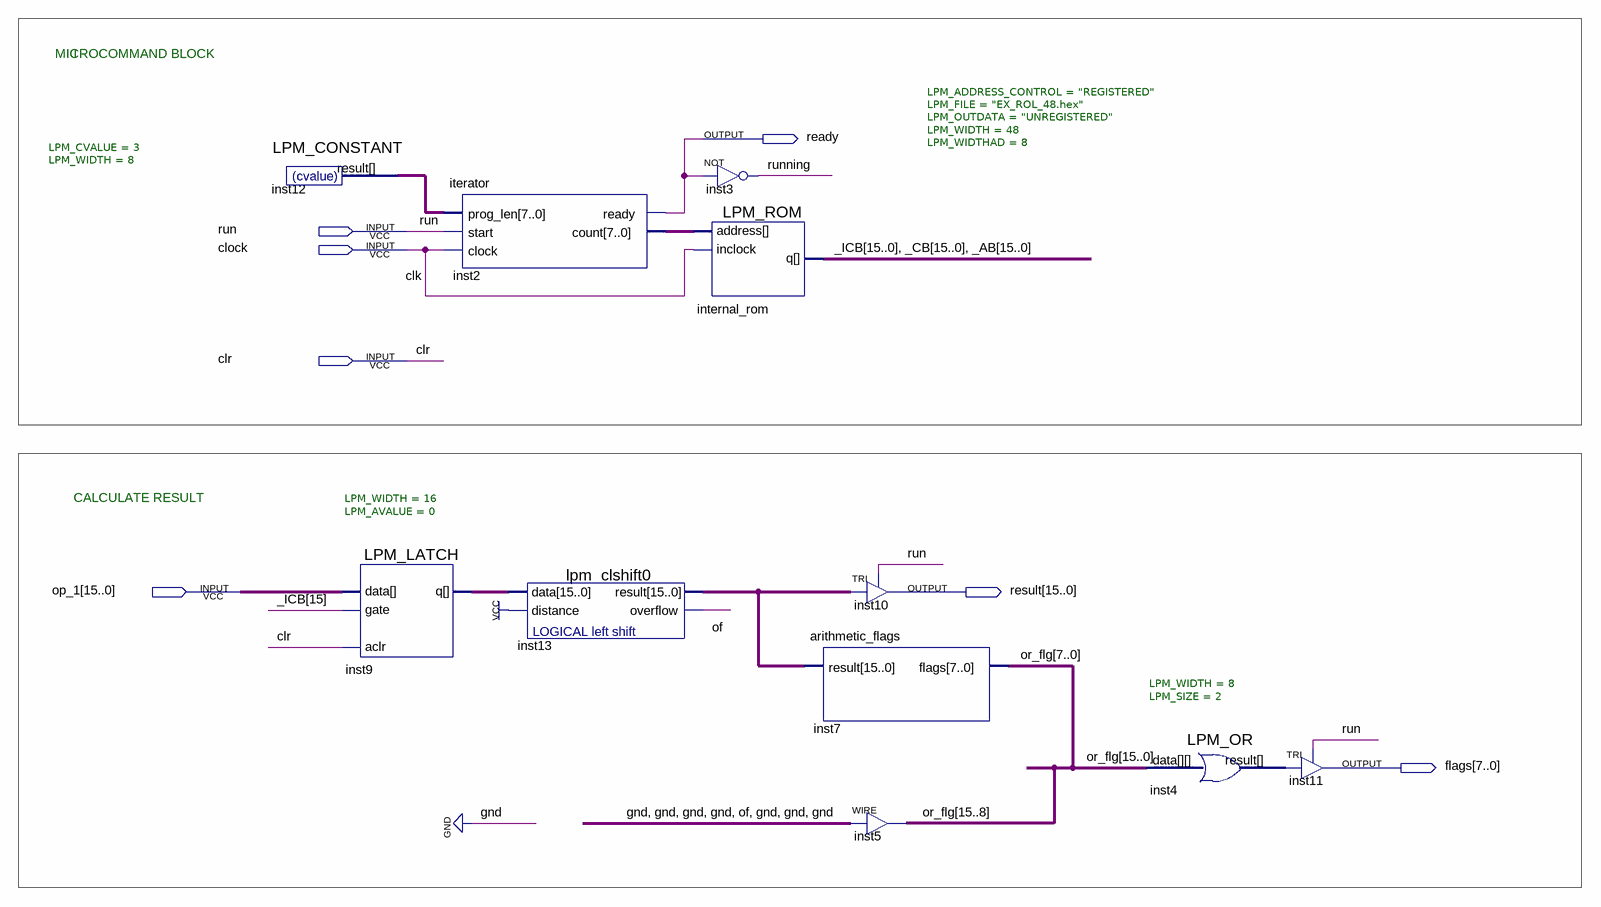
[diagram p0: schematic sheet]
// Quartus schematic EX_ROL.bdf as structural Verilog: 11 symbols, 7 pins
module EX_ROL (
  input  run,
  input  clock,
  input  clr,
  input  [15:0] op_1,
  output ready,
  output [15:0] result,
  output [7:0] flags
);

  wire of, running;
  wire [7:0] inst2_count, inst4_result, inst12_result;
  wire [15:0] _AB, _CB, _ICB, inst9_q, inst13_result, or_flg;

  LPM_CONSTANT #(.LPM_CVALUE(3), .LPM_WIDTH(8)) inst12 (.result(inst12_result));
  LPM_LATCH #(.LPM_WIDTH(16), .LPM_AVALUE(0)) inst9 (.aclr(clr), .data(op_1), .gate(_ICB[15]), .q(inst9_q));
  iterator inst2 (.prog_len(inst12_result), .start(run), .clock(clock), .ready(ready), .count(inst2_count));
  lpm_clshift0 inst13 (.data(inst9_q), .distance(1'b1), .result(inst13_result), .overflow(of));
  not inst3 (running, ready);
  LPM_ROM #(.LPM_ADDRESS_CONTROL("REGISTERED"), .LPM_FILE("EX_ROL_48.hex"), .LPM_OUTDATA("UNREGISTERED"), .LPM_WIDTH(48), .LPM_WIDTHAD(8)) internal_rom (
    .address(inst2_count), .inclock(clock), .q({_ICB, _CB, _AB}));
  TRI inst10[15:0] (.IN(inst13_result), .OE(run), .OUT(result));
  arithmetic_flags inst7 (.result(inst13_result), .flags(or_flg[7:0]));
  assign or_flg[15:8] = {4'b0000, of, 3'b000};  // WIRE inst5
  LPM_OR #(.LPM_WIDTH(8), .LPM_SIZE(2)) inst4 (.data(or_flg), .result(inst4_result));
  TRI inst11[7:0] (.IN(inst4_result), .OE(run), .OUT(flags));

  // Other names for the same wires on the sheet: clk = clock

  // Notes on the sheet:
  //   MICROCOMMAND BLOCK
  //   I
  //   CALCULATE RESULT
endmodule
